# Altium schematic sheet 8.RK3588_EMMCIO_VCCIO2.SchDoc
size A4; SheetNumber: 8; SheetTotal: 21
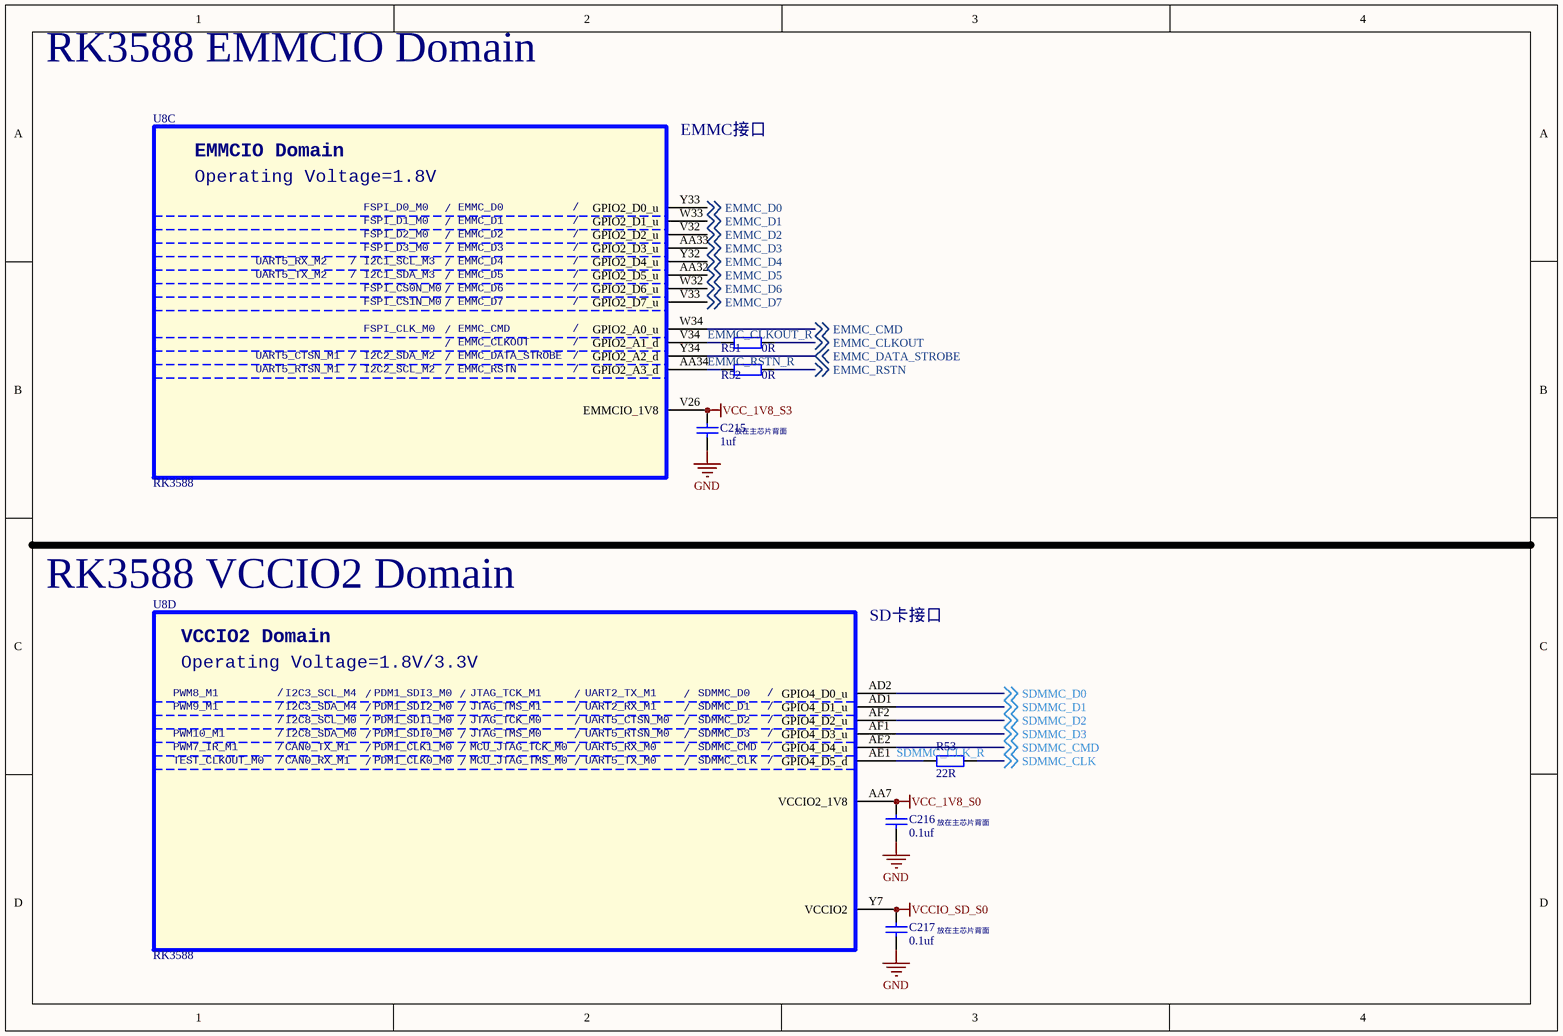
[diagram p0: 8.RK3588_EMMCIO_VCCIO2.SchDoc]

## Parts
C215  1uf  [C0201_L]
C216  0.1uf  [C0201_L]
C217  0.1uf  [C0201_L]
R51  0R  [R0201_L]
R52  0R  [R0201_L]
R53  22R  [R0402_L]
U8  RK3588  [BGA1088_23R00X23R00X2R00]  (parts C,D of 26)

## Nets
GND: C215.1 C216.1 C217.1
VCC_1V8_S0: C216.2 U8.AA7(VCCIO2_1V8)
VCC_1V8_S3: C215.2 U8.V26(EMMCIO_1V8)
VCCIO_SD_S0: C217.2 U8.Y7(VCCIO2)
EMMC_CLKOUT: R51.2 ; off-sheet EMMC_CLKOUT
EMMC_CLKOUT_R: R51.1 U8.V34(GPIO2_A1_d)
EMMC_CMD: U8.W34(GPIO2_A0_u) ; off-sheet EMMC_CMD
EMMC_D0: U8.Y33(GPIO2_D0_u) ; off-sheet EMMC_D0
EMMC_D1: U8.W33(GPIO2_D1_u) ; off-sheet EMMC_D1
EMMC_D2: U8.V32(GPIO2_D2_u) ; off-sheet EMMC_D2
EMMC_D3: U8.AA33(GPIO2_D3_u) ; off-sheet EMMC_D3
EMMC_D4: U8.Y32(GPIO2_D4_u) ; off-sheet EMMC_D4
EMMC_D5: U8.AA32(GPIO2_D5_u) ; off-sheet EMMC_D5
EMMC_D6: U8.W32(GPIO2_D6_u) ; off-sheet EMMC_D6
EMMC_D7: U8.V33(GPIO2_D7_u) ; off-sheet EMMC_D7
EMMC_DATA_STROBE: U8.Y34(GPIO2_A2_d) ; off-sheet EMMC_DATA_STROBE
EMMC_RSTN: R52.2 ; off-sheet EMMC_RSTN
EMMC_RSTN_R: R52.1 U8.AA34(GPIO2_A3_d)
SDMMC_CLK: R53.2 ; off-sheet SDMMC_CLK
SDMMC_CLK_R: R53.1 U8.AE1(GPIO4_D5_d)
SDMMC_CMD: U8.AE2(GPIO4_D4_u) ; off-sheet SDMMC_CMD
SDMMC_D0: U8.AD2(GPIO4_D0_u) ; off-sheet SDMMC_D0
SDMMC_D1: U8.AD1(GPIO4_D1_u) ; off-sheet SDMMC_D1
SDMMC_D2: U8.AF2(GPIO4_D2_u) ; off-sheet SDMMC_D2
SDMMC_D3: U8.AF1(GPIO4_D3_u) ; off-sheet SDMMC_D3

## Notes on the sheet
- RK3588 EMMCIO Domain
- EMMC接口
- (near C215) 放在主芯片背面
- RK3588 VCCIO2 Domain
- SD卡接口
- 放在主芯片背面
- (near C217) 放在主芯片背面
- (in symbol SOC_RK3588, part C) EMMCIO Domain; Operating Voltage=1.8V; FSPI_D0_M0; /; EMMC_D0; FSPI_D1_M0; EMMC_D1; FSPI_D2_M0; EMMC_D2; FSPI_D3_M0; EMMC_D3; UART5_RX_M2; I2C1_SCL_M3; EMMC_D4; UART5_TX_M2; I2C1_SDA_M3; EMMC_D5; FSPI_CS0N_M0; EMMC_D6; FSPI_CS1N_M0; EMMC_D7; FSPI_CLK_M0; EMMC_CMD; EMMC_CLKOUT; UART5_CTSN_M1; I2C2_SDA_M2; EMMC_DATA_STROBE; UART5_RTSN_M1; I2C2_SCL_M2; EMMC_RSTN
- (in symbol SOC_RK3588, part D) VCCIO2 Domain; Operating Voltage=1.8V/3.3V; PWM8_M1; /; I2C3_SCL_M4; PDM1_SDI3_M0; JTAG_TCK_M1; UART2_TX_M1; SDMMC_D0; PWM9_M1; I2C3_SDA_M4; PDM1_SDI2_M0; JTAG_TMS_M1; UART2_RX_M1; SDMMC_D1; I2C8_SCL_M0; PDM1_SDI1_M0; JTAG_TCK_M0; UART5_CTSN_M0; SDMMC_D2; PWM10_M1; I2C8_SDA_M0; PDM1_SDI0_M0; JTAG_TMS_M0; UART5_RTSN_M0; SDMMC_D3; PWM7_IR_M1; CAN0_TX_M1; PDM1_CLK1_M0; MCU_JTAG_TCK_M0; UART5_RX_M0; SDMMC_CMD; TEST_CLKOUT_M0; CAN0_RX_M1; PDM1_CLK0_M0; MCU_JTAG_TMS_M0; UART5_TX_M0; SDMMC_CLK

## Library data of the parts
C215-C217 = C: 贴片电容/MLCC电容
R51-R53 = R: 贴片电阻
U8 = SOC_RK3588: ROCKCHIP SOC